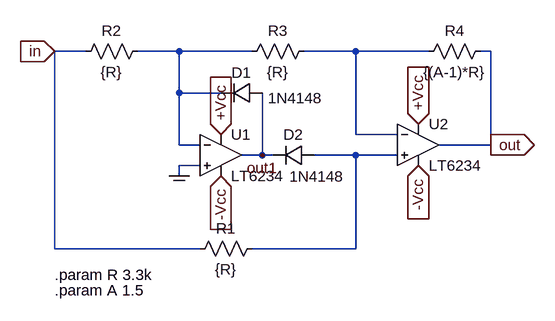
[diagram p0: schematic Etaj4-symb.asc]
Etaj4-symb.asc, the LTspice schematic file:
Version 4
SHEET 1 880 680
WIRE -48 0 -96 0
WIRE 96 0 32 0
WIRE 208 0 96 0
WIRE 368 0 288 0
WIRE 480 0 368 0
WIRE 576 0 560 0
WIRE 96 64 96 0
WIRE 160 64 96 64
WIRE 368 128 368 0
WIRE 432 128 368 128
WIRE 96 144 96 64
WIRE 128 144 96 144
WIRE 576 144 576 0
WIRE 576 144 496 144
WIRE 224 160 224 64
WIRE 224 160 192 160
WIRE 240 160 224 160
WIRE 368 160 304 160
WIRE 432 160 368 160
WIRE 128 176 96 176
WIRE 96 192 96 176
WIRE -96 304 -96 0
WIRE 128 304 -96 304
WIRE 368 304 368 160
WIRE 368 304 208 304
FLAG 96 192 COM
IOPIN 96 192 In
FLAG 464 112 +Vcc
IOPIN 464 112 In
FLAG 464 176 -Vcc
IOPIN 464 176 In
FLAG -96 0 in
IOPIN -96 0 In
FLAG 576 144 out
IOPIN 576 144 Out
FLAG 224 160 out1
FLAG 160 192 -Vcc
IOPIN 160 192 In
FLAG 160 128 +Vcc
IOPIN 160 128 In
DATAFLAG 576 0 ""
DATAFLAG 576 0 ""
SYMBOL res 224 288 R90
WINDOW 0 0 56 VBottom 2
WINDOW 3 32 56 VTop 2
SYMATTR InstName R1
SYMATTR Value {R}
SYMBOL res 48 -16 R90
WINDOW 0 0 56 VBottom 2
WINDOW 3 32 56 VTop 2
SYMATTR InstName R2
SYMATTR Value {R}
SYMBOL res 304 -16 R90
WINDOW 0 0 56 VBottom 2
WINDOW 3 32 56 VTop 2
SYMATTR InstName R3
SYMATTR Value {R}
SYMBOL res 576 -16 R90
WINDOW 0 0 56 VBottom 2
WINDOW 3 32 56 VTop 2
SYMATTR InstName R4
SYMATTR Value {(A-1)*R}
SYMBOL diode 224 48 R90
WINDOW 0 0 32 VBottom 2
WINDOW 3 8 -51 VTop 2
SYMATTR InstName D1
SYMATTR Value 1N4148
SYMBOL diode 304 144 R90
WINDOW 0 0 32 VBottom 2
WINDOW 3 33 -4 VTop 2
SYMATTR InstName D2
SYMATTR Value 1N4148
SYMBOL OpAmps\\LT6234 160 160 R0
SYMATTR InstName U1
SYMBOL OpAmps\\LT6234 464 144 R0
SYMATTR InstName U2
TEXT -96 344 Left 2 !.param R 3.3k
TEXT -96 368 Left 2 !.param A 1.5

The netlist it stands for:
* Etaj4-symb.asc
R1 N003 in {R}
R2 N001 in {R}
R3 N002 N001 {R}
R4 out N002 {(A-1)*R}
D1 out1 N001 1N4148
D2 N003 out1 1N4148
* U1: LT6234 (symbol OpAmps\LT6234 not available, pins judged from their places): In+=COM In-=N001 V+=+Vcc V-=-Vcc OUT=out1
* U2: LT6234 (symbol OpAmps\LT6234 not available, pins judged from their places): In+=N003 In-=N002 V+=+Vcc V-=-Vcc OUT=out
.model D D
.lib standard.dio
.param R 3.3k
.param A 1.5
.backanno
.end